# EAGLE design amplifier_v0001 (EAGLE 6.4)
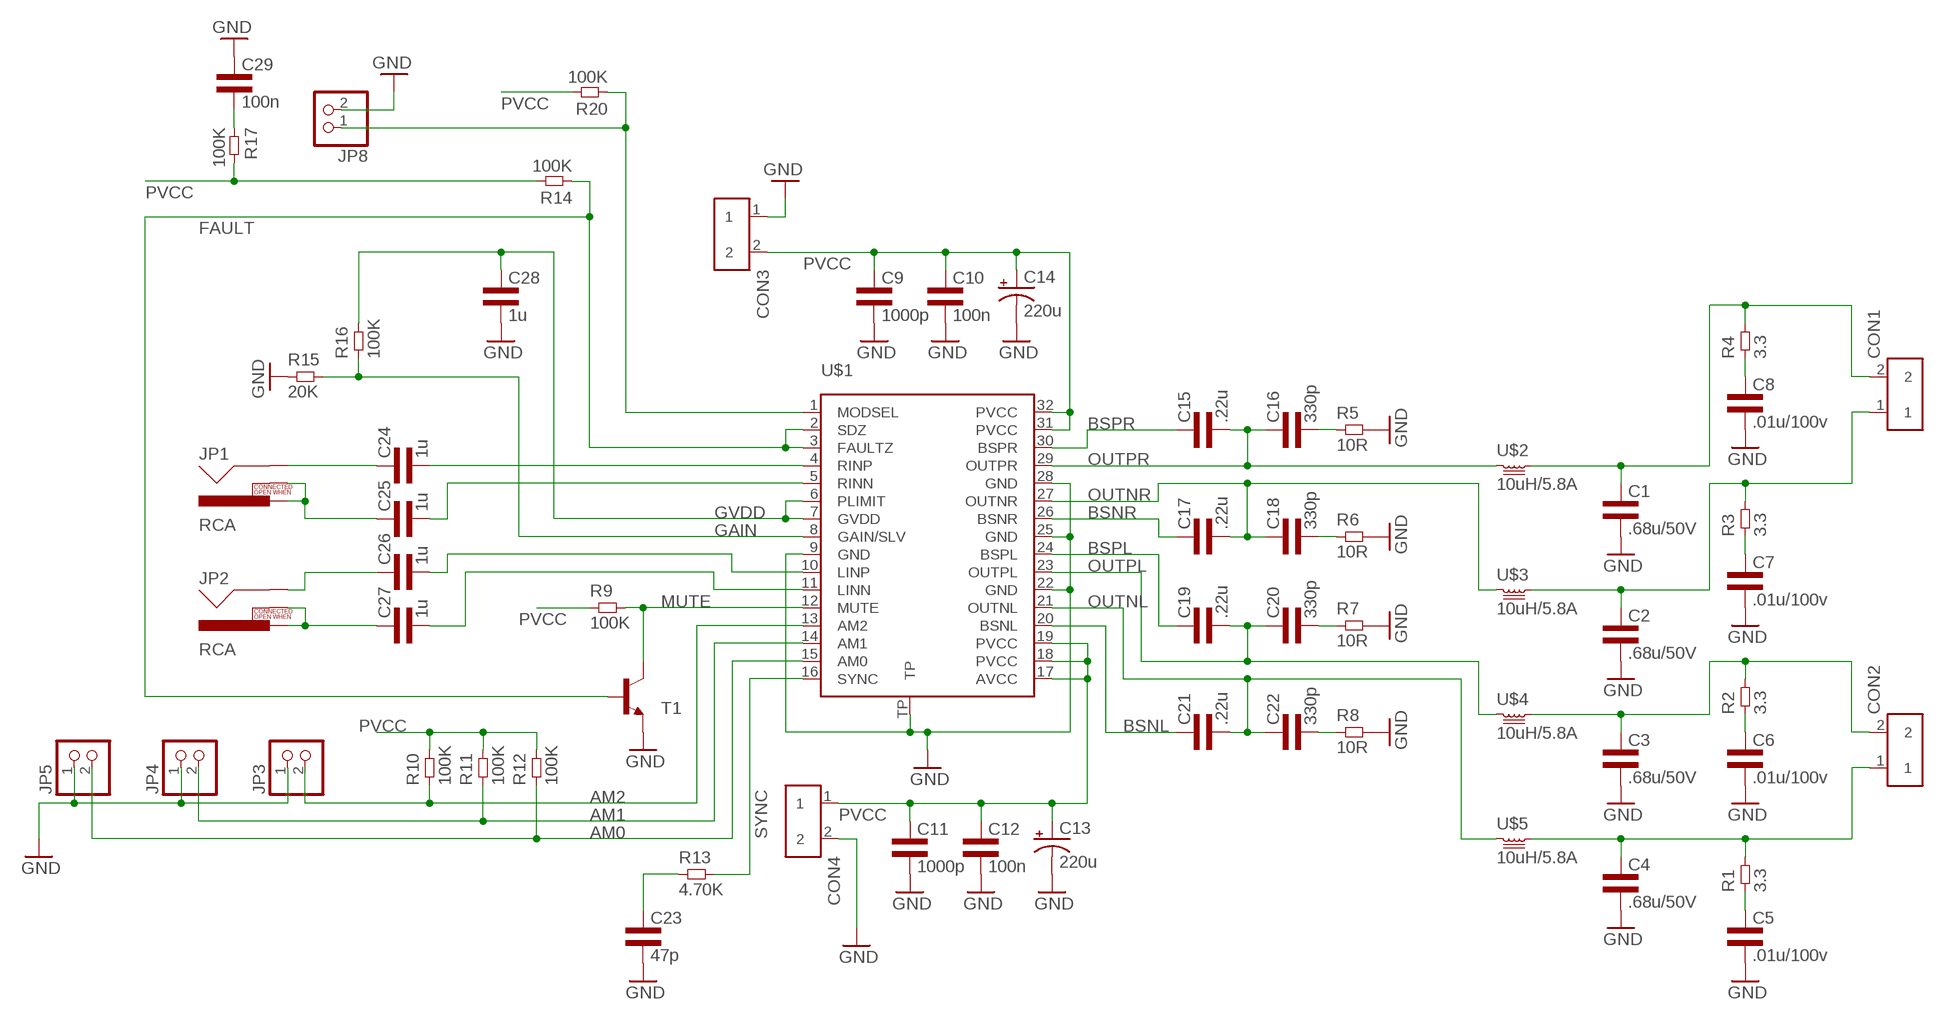
[diagram p0: schematic, sheet 1]

## Parts
C1  .68u/50V  CAP1206L3  [1206L3]
C2  .68u/50V  CAP1206L3  [1206L3]
C3  .68u/50V  CAP1206L3  [1206L3]
C4  .68u/50V  CAP1206L3  [1206L3]
C5  .01u/100v  CAP0805L3  [0805L3]
C6  .01u/100v  CAP0805L3  [0805L3]
C7  .01u/100v  CAP0805L3  [0805L3]
C8  .01u/100v  CAP0805L3  [0805L3]
C9  1000p  CAP0603L3  [0603L3]
C10  100n  CAP0603L3  [0603L3]
C11  1000p  CAP0603L3  [0603L3]
C12  100n  CAP0603L3  [0603L3]
C13  220u  CPOL-USE3.5-8  [E3,5-8]
C14  220u  CPOL-USE3.5-8  [E3,5-8]
C15  .22u  CAP0603L3  [0603L3]
C16  330p  CAP0603L3  [0603L3]
C17  .22u  CAP0603L3  [0603L3]
C18  330p  CAP0603L3  [0603L3]
C19  .22u  CAP0603L3  [0603L3]
C20  330p  CAP0603L3  [0603L3]
C21  .22u  CAP0603L3  [0603L3]
C22  330p  CAP0603L3  [0603L3]
C23  47p  CAP0603L3  [0603L3]
C24  1u  CAP0603L3  [0603L3]
C25  1u  CAP0603L3  [0603L3]
C26  1u  CAP0603L3  [0603L3]
C27  1u  CAP0603L3  [0603L3]
C28  1u  CAP0603L3  [0603L3]
C29  100n  CAP0603L3  [0603L3]
CON1  TERM_BLOCK_2  [TERM_BLOCK_2]
CON2  TERM_BLOCK_2  [TERM_BLOCK_2]
CON3  TERM_BLOCK_2  [TERM_BLOCK_2]
CON4  TERM_BLOCK_2  [TERM_BLOCK_2]
JP1  RCA  [RCA]
JP2  RCA  [RCA]
JP3  PINHD-1X2  [1X02]
JP4  PINHD-1X2  [1X02]
JP5  PINHD-1X2  [1X02]
JP8  PINHD-1X2  [1X02]
R1  3.3  RES0603L3  [0603L3]
R2  3.3  RES0603L3  [0603L3]
R3  3.3  RES0603L3  [0603L3]
R4  3.3  RES0603L3  [0603L3]
R5  10R  RES0805L3  [0805L3]
R6  10R  RES0805L3  [0805L3]
R7  10R  RES0805L3  [0805L3]
R8  10R  RES0805L3  [0805L3]
R9  100K  RES0603L3  [0603L3]
R10  100K  RES0603L3  [0603L3]
R11  100K  RES0603L3  [0603L3]
R12  100K  RES0603L3  [0603L3]
R13  4.70K  RES0603L3  [0603L3]
R14  100K  RES0603L3  [0603L3]
R15  20K  RES0603L3  [0603L3]
R16  100K  RES0603L3  [0603L3]
R17  100K  RES0603L3  [0603L3]
R20  100K  RES0603L3  [0603L3]
T1  TRANSISTOR_MMBT2222ALT1-NPN-SOT23-BEC  [TRANSISTOR_SOT23-BEC]
U$1  TPA3116  [R-PDSO-32]
U$2  10uH/5.8A  INDUCTORDR127  [DR127]
U$3  10uH/5.8A  INDUCTORDR127  [DR127]
U$4  10uH/5.8A  INDUCTORDR127  [DR127]
U$5  10uH/5.8A  INDUCTORDR127  [DR127]

## Nets
AM0: JP5.2 R12.P$1 U$1.15(AM0)
AM1: JP4.2 R11.P$1 U$1.14(AM1)
AM2: JP3.2 R10.P$1 U$1.13(AM2)
BSNL: C21.P$1 U$1.20(BSNL)
BSNR: C17.P$1 U$1.26(BSNR)
BSPL: C19.P$1 U$1.24(BSPL)
BSPR: C15.P$1 U$1.30(BSPR)
FAULT: R14.P$1 T1.B U$1.2(SDZ) U$1.3(FAULTZ)
GAIN: R15.P$2 R16.P$1 U$1.8(GAIN/SLV)
GND: C1.2 C2.2 C3.2 C4.2 C5.2 C6.2 C7.2 C8.2 C9.P$2 C10.P$2 C11.P$2 C12.P$2 C13.- C14.- C23.P$2 C28.P$2 C29.P$1 CON3.1 CON4.2 JP3.1 JP4.1 JP5.1 JP8.2 R5.2 R6.2 R7.2 R8.2 R15.P$1 T1.E U$1.9(GND) U$1.22(GND) U$1.25(GND) U$1.28(GND) U$1.TP
GVDD: C28.P$1 R16.P$2 U$1.6(PLIMIT) U$1.7(GVDD)
LEFT+: C3.1 CON2.2 R2.P$2 U$4.2
LEFT-: C4.1 CON2.1 R1.P$2 U$5.2
MUTE: R9.P$2 T1.C U$1.12(MUTE)
N$1: C27.P$2 U$1.11(LINN)
N$2: C26.P$2 U$1.10(LINP)
N$3: C24.P$2 U$1.4(RINP)
N$4: JP8.1 R20.P$1 U$1.1(MODSEL)
N$5: C16.P$2 R5.1
N$6: C25.P$2 U$1.5(RINN)
N$7: C29.P$2 R17.P$1
N$8: C18.P$2 R6.1
N$9: C5.1 R1.P$1
N$10: C6.1 R2.P$1
N$11: C7.1 R3.P$1
N$12: C8.1 R4.P$1
N$14: C20.P$2 R7.1
N$17: C24.P$1 JP1.SHELL
N$18: C25.P$1 JP1.PIN JP1.SWITCH
N$19: C22.P$2 R8.1
N$20: C23.P$1 R13.P$1
N$23: C27.P$1 JP2.PIN JP2.SWITCH
N$24: C26.P$1 JP2.SHELL
OUTNL: C21.P$2 C22.P$1 U$1.21(OUTNL) U$5.1
OUTNR: C17.P$2 C18.P$1 U$1.27(OUTNR) U$3.1
OUTPL: C19.P$2 C20.P$1 U$1.23(OUTPL) U$4.1
OUTPR: C15.P$2 C16.P$1 U$1.29(OUTPR) U$2.1
PVCC: C9.P$1 C10.P$1 C11.P$1 C12.P$1 C13.+ C14.+ CON3.2 CON4.1 R9.P$1 R10.P$2 R11.P$2 R12.P$2 R14.P$2 R17.P$2 R20.P$2 U$1.17(AVCC) U$1.18(PVCC) U$1.19(PVCC) U$1.31(PVCC) U$1.32(PVCC)
RIGHT+: C1.1 CON1.2 R4.P$2 U$2.2
RIGHT-: C2.1 CON1.1 R3.P$2 U$3.2
SYNC: R13.P$2 U$1.16(SYNC)

## Library data of the parts
C1-C12 C15-C29 = common:CAP
C13 C14 = rcl:CPOL-US: POLARIZED CAPACITOR, American symbol
CON1-CON4 = common:TERM_BLOCK_2
JP1 JP2 = SparkFun-Connectors:RCA
JP3-JP5 JP8 = pinhead:PINHD-1X2: PIN HEADER
R1-R17 R20 = common:RES
T1 = logic:TRANSISTOR_*-NPN-: NPN Transistror BF959 corrected 2008.03.06
U$1 = common:TPA3116: TPA3116D2 15-W, 30-W, 50-W Filter-Free Class-D Stereo Amplifier Family With AM Avoidance
U$2-U$5 = common:INDUCTOR

## Board
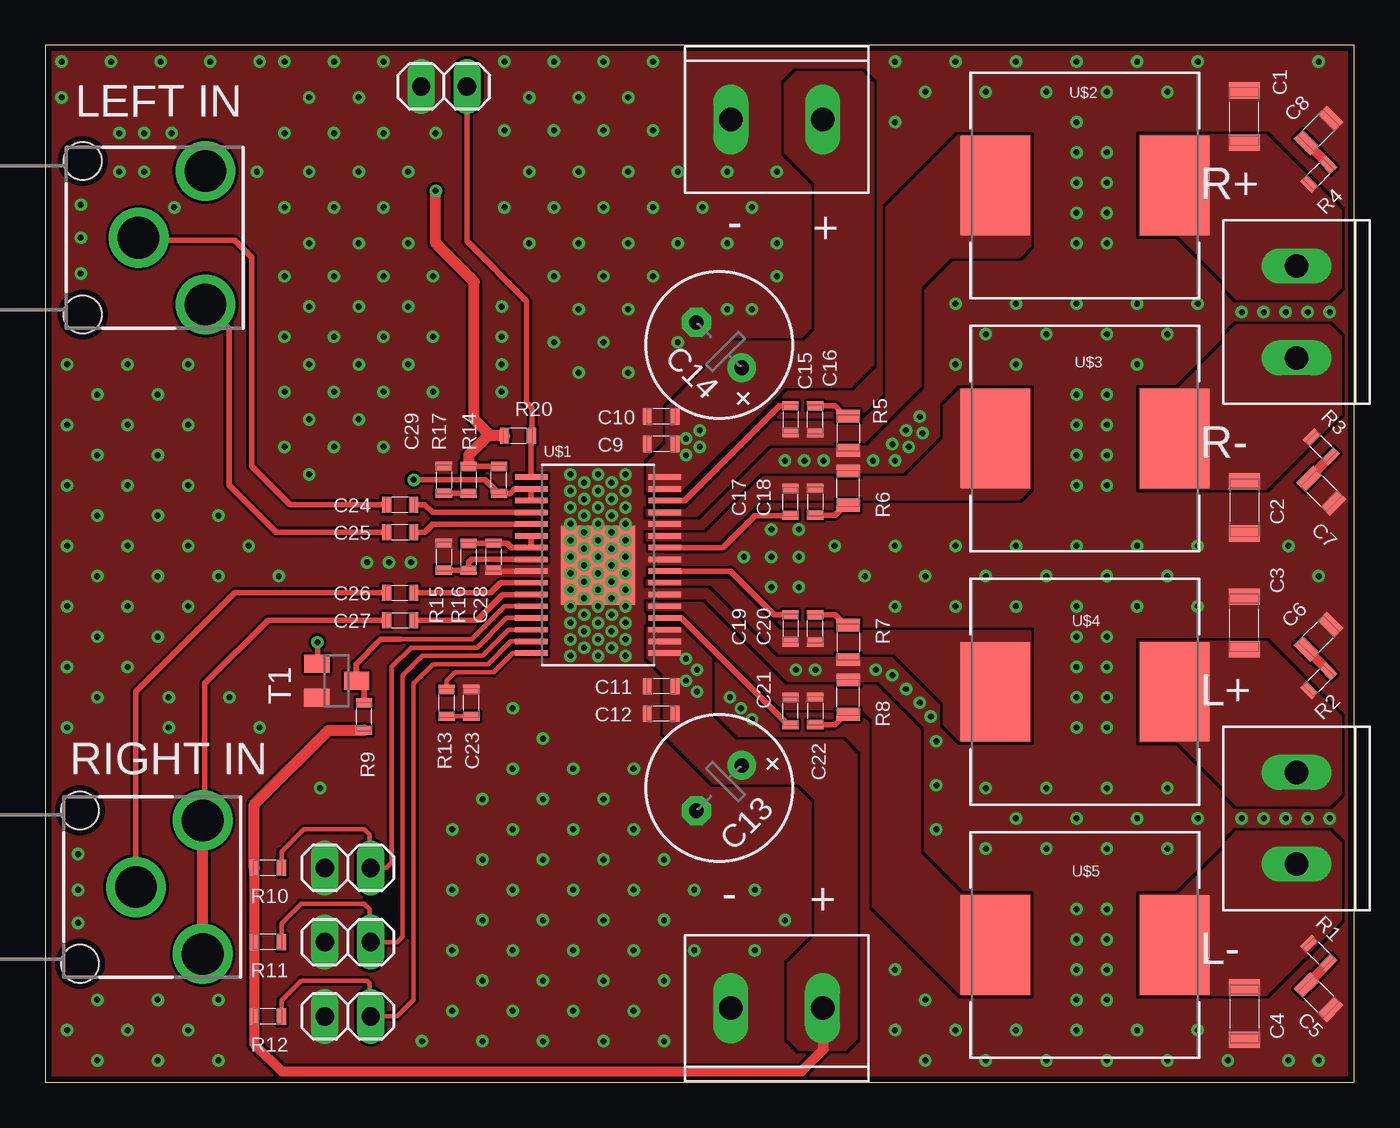
[diagram p1: board, top side]
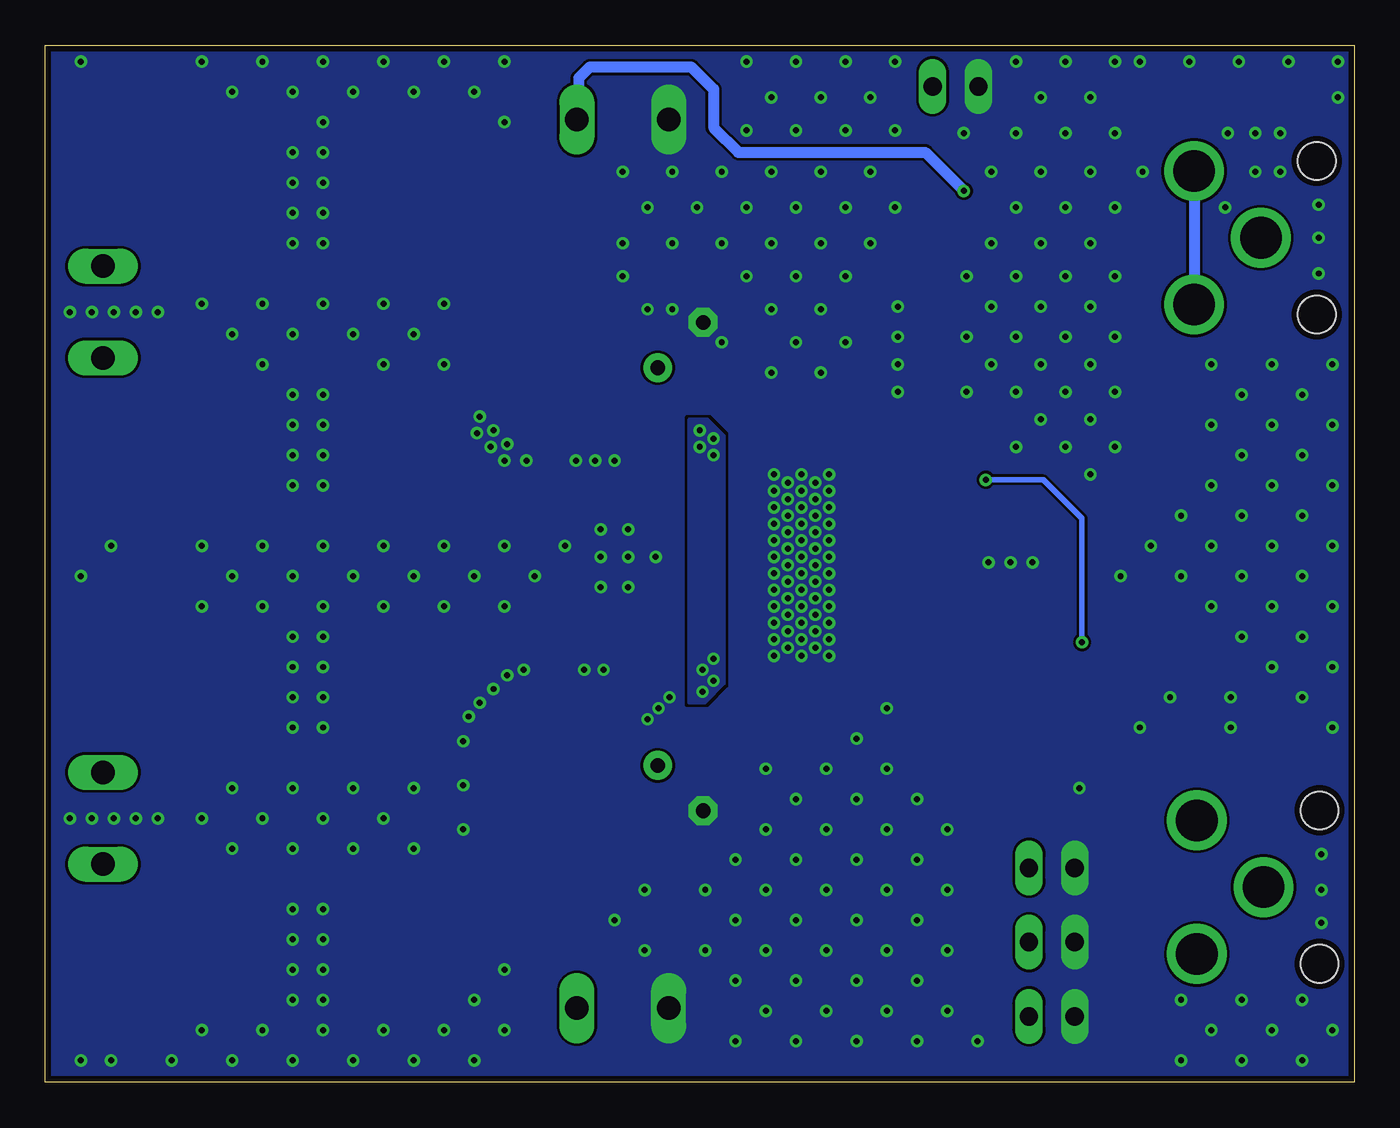
[diagram p2: board, bottom side, seen from below]

Size 72.54 x 57.45 mm. Coordinates in mm from the lower left corner, seen from the top.
Outline: 72.54,0 72.54,57.46 0,57.46 0,0 72.54,0
Copper layers (1*16): Top 0.035mm / dielectric 1.5mm / Bottom 0.035mm
Design rules "default *": minimum track width 6mil, minimum drill 13mil, track to track 6mil, track to pad 6mil, pad to pad 6mil, via to via 6mil, smd to smd 6mil, copper to edge 13mil, drill to drill 6mil, minimum pad ring 7mil, minimum via ring 7mil, stop-mask expansion 4mil, vias tented up to drill 16mil, thermal gap 10mil

### Footprints (pad centres in the part's own frame; a part is rotated, then mirrored left to right if it is on the bottom)
1206L3 = smd 0.9 x 1.7: 1 -1.45,0; 2 1.45,0
0805L3 = smd 0.7 x 1.3: 1 -0.95,0; 2 0.95,0
0603L3 = smd 0.5 x 0.9: P$1 -0.75,0; P$2 0.75,0
E3,5-8 = drill 0.813 pad 1.6: + -1.778,0 | drill 0.813 pad 1.6 octagon: - 1.778,0
TERM_BLOCK_2 = drill 1.3 long: 1 -2.54,0; 2 2.54,0
RCA = drill 2.3: PIN 3.7,3.7; SHELL 0,0; SWITCH 3.7,-3.7 | hole 2.1: -3.1,4.25; -3.1,-4.25
1X02 = drill 1.016 long: 1 -1.27,0; 2 1.27,0
TRANSISTOR_SOT23-BEC = smd 1 x 1.4: B -0.95,-1.1; C 0,1.1; E 0.95,-1.1
R-PDSO-32 = smd 0.3 x 1.8: 1 -4.875,-3.7; 2 -4.225,-3.7; 3 -3.575,-3.7; 4 -2.925,-3.7; 5 -2.275,-3.7; 6 -1.625,-3.7; 7 -0.975,-3.7; 8 -0.325,-3.7; 9 0.325,-3.7; 10 0.975,-3.7; 11 1.625,-3.7; 12 2.275,-3.7; 13 2.925,-3.7; 14 3.575,-3.7; 15 4.225,-3.7; 16 4.875,-3.7; 17 4.875,3.7; 18 4.225,3.7; 19 3.575,3.7; 20 2.925,3.7; 21 2.275,3.7; 22 1.625,3.7; 23 0.975,3.7; 24 0.325,3.7; 25 -0.325,3.7; 26 -0.975,3.7; 27 -1.625,3.7; 28 -2.275,3.7; 29 -2.925,3.7; 30 -3.575,3.7; 31 -4.225,3.7; 32 -4.875,3.7 | smd 4.36 x 4.11: TP 0,0
DR127 = smd 3.85 x 5.5: 1 -4.975,0; 2 4.975,0

### Placement (x,y rotation side)
C1  66.45,53.49 90 top
C2  66.45,31.85 270 top
C3  66.45,25.45 90 top
C4  66.45,3.81 270 top
C5  70.56,4.72 315 top
C6  70.56,24.69 45 top
C7  70.71,32.77 315 top
C8  70.56,52.73 45 top
C9  34.14,35.36 180 top
C10  34.14,36.88 180 top
C11  34.14,21.95 180 top
C12  34.14,20.42 180 top
C13  37.34,16.31 225 top
C14  37.34,40.84 135 top
C15  41.3,36.73 270 top
C16  42.67,36.73 90 top
C17  41.3,32.16 90 top
C18  42.67,32.16 270 top
C19  41.3,25.15 270 top
C20  42.67,25.15 90 top
C21  41.3,20.57 90 top
C22  42.67,20.57 270 top
C23  23.62,21.03 90 top
C24  19.66,32 0 top
C25  19.66,30.48 0 top
C26  19.66,27.13 0 top
C27  19.66,25.6 0 top
C28  24.84,29.11 270 top
C29  22.1,33.38 270 top
CON1  69.34,42.67 90 top
CON2  69.34,14.63 90 top
CON3  40.54,4.11 0 top
CON4  40.54,53.34 180 top
JP1  5.18,46.79 0 top
JP2  5.03,10.82 0 top
JP3  16.76,11.89 0 top
JP4  16.76,7.77 0 top
JP5  16.76,3.66 0 top
JP8  22.1,55.17 180 top
R1  70.56,7.16 135 top
R2  70.56,22.25 225 top
R3  70.71,35.2 135 top
R4  70.56,50.29 225 top
R5  44.5,35.97 270 top
R6  44.5,32.92 90 top
R7  44.5,24.38 270 top
R8  44.5,21.34 90 top
R9  17.68,20.27 90 top
R10  12.34,11.89 180 top
R11  12.34,7.77 180 top
R12  12.34,3.66 180 top
R13  22.25,21.03 90 top
R14  25.15,33.38 90 top
R15  22.1,29.11 270 top
R16  23.47,29.11 90 top
R17  23.47,33.38 90 top
R20  26.21,35.81 180 top
T1  16.15,22.25 270 top
U$1  30.63,28.65 270 top
U$2  57.61,49.68 0 top
U$3  57.61,35.66 0 top
U$4  57.61,21.64 0 top
U$5  57.61,7.62 0 top

### Tracks (layer width: path | path; a pad name or v marks a point on that pad's centre or on a via)
AM0
  Top 0.254: U$1.15 25.8,24.43 24.54,23.17 21.49,23.17 20.42,22.1 20.42,4.57 19.51,3.66 JP5.2 17.98,3.71 17.98,5.49 17.83,5.64 14.17,5.64 13.09,4.56 R12.P$1
AM1
  Top 0.254: U$1.14 25.69,25.08 24.23,23.62 20.88,23.62 19.81,22.56 19.81,8.08 19.51,7.77 JP4.2 17.98,7.82 17.98,9.6 17.68,9.91 14.17,9.91 13.09,8.83 R11.P$1
AM2
  Top 0.254: U$1.13 25.57,25.73 23.93,24.08 20.27,24.08 19.2,23.01 19.2,12.19 18.9,11.89 JP3.2 17.98,11.94 17.98,13.72 17.68,14.02 14.33,14.02 13.09,12.79 R10.P$1
BSNL
  Top 0.305: U$1.20 35.23,25.73 41.15,19.81 41.29,19.81 C21.P$1
BSNR
  Top 0.305: U$1.26 37.55,29.63 39.32,31.39 41.29,31.39 C17.P$1
BSPL
  Top 0.305: U$1.24 37.97,28.33 40.39,25.91 41.29,25.91 C19.P$1
BSPR
  Top 0.305: U$1.30 35.43,32.23 40.69,37.49 41.29,37.49 C15.P$1
FAULT  (via drill 0.33)
  Top 0.305: U$1.3 U$1.2 26.02,32.88 25.76,32.61 25.16,32.61 R14.P$1 24.38,33.38 v20.42,33.38 | v15.09,24.38 15.09,23.23 T1.B
  Bottom 0.305: v15.09,24.38 15.09,31.24 17.22,33.38 v20.42,33.38
GAIN
  Top 0.305: R15.P$2 23.32,28.36 | 23.32,28.36 R16.P$1 | U$1.8 23.64,28.98 23.47,28.8 23.47,28.51 23.32,28.36
GND  (via drill 0.33)
  Top 0.305: U$1.9 24.87,28.33 C28.P$2
  other vias: 42.06,34.44 43.13,34.44 29.11,30.02 29.11,29.11 29.11,28.19 29.11,27.28 29.87,29.57 29.87,28.65 29.87,27.74 29.87,26.82 29.87,30.48 30.63,30.02 30.63,29.11 30.63,28.19 30.63,27.28 31.39,30.48 31.39,29.57 31.39,28.65 31.39,27.74 31.39,26.82 32.16,27.28 32.16,28.19 32.16,29.11 32.16,30.02 29.11,30.94 29.11,31.85 29.11,32.77 29.11,33.68 29.87,31.39 29.87,32.31 29.87,33.22 30.63,33.68 30.63,32.77 30.63,31.85 30.63,30.94 31.39,33.22 31.39,32.31 31.39,31.39 32.16,33.68 32.16,32.77 32.16,31.85 32.16,30.94 29.11,26.37 29.11,25.45 29.11,24.54 29.11,23.62 29.87,25.91 29.87,24.99 29.87,24.08 30.63,26.37 30.63,25.45 30.63,24.54 30.63,23.62 31.39,25.91 31.39,24.99 31.39,24.08 32.16,26.37 32.16,25.45 32.16,24.54 32.16,23.62 41,34.44 38.71,29.11 40.23,29.11 40.23,30.63 40.23,27.43 41.76,29.11 41.76,30.63 41.76,27.43 37.95,21.34 39.17,20.12 38.56,20.73 41.61,22.86 42.67,22.86 46.02,22.86 46.94,22.56 47.7,21.79 48.46,21.03 49.07,20.27 49.38,18.9 49.38,16.46 49.38,14.02 66.29,14.63 67.51,14.63 68.73,14.63 69.95,14.63 71.17,14.63 71.17,42.67 69.95,42.67 68.73,42.67 67.51,42.67 66.29,42.67 45.87,34.44 47.09,34.44 47.85,35.2 47.85,35.2 48.62,35.97 46.94,35.36 47.7,36.12 48.46,36.88 0.91,56.54 3.66,56.54 6.4,56.54 9.14,56.54 11.89,56.54 13.26,56.54 16,56.54 25.45,56.54 28.19,56.54 30.94,56.54 33.68,56.54 0.91,54.56 14.63,54.56 17.37,54.56 13.26,52.58 16,52.58 26.82,54.56 29.57,54.56 32.31,54.56 28.19,52.73 30.94,52.73 33.68,52.73 29.57,50.44 32.31,50.44 14.63,50.44 17.37,50.44 33.68,48.46 30.94,48.46 28.19,48.46 25.45,52.73 26.82,50.44 25.45,48.46 26.82,46.48 29.57,46.48 32.31,46.48 33.68,44.65 30.94,44.65 28.19,44.65 32.31,42.82 29.57,42.82 28.19,41 30.94,41 29.57,39.32 32.31,39.32 13.26,48.46 16,48.46 17.37,46.48 14.63,46.48 16,44.65 13.26,44.65 14.63,42.98 17.37,42.98 13.26,41.3 16,41.3 17.37,39.78 14.63,39.78 35.05,50.44 37.8,50.44 40.54,50.44 36.42,48.46 39.17,48.46 35.05,46.48 37.8,46.48 40.54,46.48 40.54,44.65 37.8,42.82 39.17,42.82 35.05,41 13.26,38.25 16,38.25 14.63,36.73 17.37,36.73 13.26,35.2 16,35.2 18.75,56.54 18.75,52.58 18.75,48.46 18.75,44.65 18.75,41.3 18.75,38.25 18.75,35.2 21.64,52.58 20.12,50.44 14.63,33.68 21.49,38.25 20.12,39.78 21.49,41.3 20.12,42.98 21.49,44.65 20.12,46.48 11.73,50.44 25.3,41.3 25.3,39.78 25.3,38.25 25.3,42.98 7.01,52.58 5.49,52.58 4.11,52.58 5.49,50.44 4.11,50.44 1.98,48.62 7.16,48.46 25.91,20.73 27.58,19.05 25.91,17.37 29.26,17.37 30.94,15.7 32.61,17.37 27.58,15.7 29.26,14.02 30.94,12.34 32.61,10.67 34.29,8.99 32.61,14.02 34.29,12.34 35.97,10.67 24.23,15.7 25.91,14.02 27.58,12.34 29.26,10.67 30.94,8.99 32.61,7.32 34.29,5.64 22.56,14.02 24.23,12.34 25.91,10.67 27.58,8.99 29.26,7.32 30.94,5.64 32.61,3.96 34.29,2.29 30.94,2.29 27.58,2.29 24.23,2.29 20.88,2.29 29.26,3.96 25.91,3.96 22.56,3.96 24.23,5.64 27.58,5.64 25.91,7.32 24.23,8.99 22.56,10.67 22.56,7.32 1.22,39.78 4.57,39.78 2.9,38.1 7.92,39.78 6.25,38.1 1.22,36.42 4.57,36.42 7.92,36.42 2.9,34.75 6.25,34.75 1.22,33.07 4.57,33.07 7.92,33.07 2.9,31.39 6.25,31.39 7.92,29.72 4.57,29.72 1.22,29.72 11.28,29.72 2.9,28.04 6.25,28.04 9.6,28.04 1.22,26.37 4.57,26.37 7.92,26.37 2.9,24.69 6.25,24.69 1.22,23.01 4.57,23.01 2.9,21.34 1.22,19.66 9.6,31.39 12.95,28.04 1.22,2.9 2.9,4.57 4.57,2.9 6.25,4.57 7.92,2.9 9.6,4.57 6.25,1.22 2.9,1.22 9.6,1.22 35.97,7.32 39.32,7.32 41,8.99 39.32,10.67 47.09,56.54 48.77,54.86 50.44,56.54 52.12,54.86 53.8,56.54 55.47,54.86 57.15,56.54 58.83,54.86 60.5,56.54 62.18,54.86 63.86,56.54 57.15,53.19 58.83,51.51 58.83,48.16 57.15,46.48 53.8,43.13 50.44,43.13 52.12,41.45 50.44,39.78 53.8,39.78 55.47,41.45 57.15,43.13 60.5,43.13 63.86,43.13 58.83,41.45 62.18,41.45 60.5,39.78 57.15,38.1 57.15,36.42 57.15,34.75 57.15,33.07 58.83,38.1 58.83,36.42 58.83,34.75 58.83,33.07 43.74,29.72 47.09,29.72 50.44,29.72 53.8,29.72 57.15,29.72 60.5,29.72 63.86,29.72 45.42,28.04 48.77,28.04 52.12,28.04 55.47,28.04 58.83,28.04 62.18,28.04 47.09,26.37 50.44,26.37 53.8,26.37 57.15,26.37 60.5,26.37 63.86,26.37 57.15,24.69 57.15,23.01 57.15,21.34 57.15,19.66 58.83,24.69 58.83,23.01 58.83,21.34 58.83,19.66 52.12,16.31 55.47,16.31 58.83,16.31 62.18,16.31 53.8,14.63 57.15,14.63 60.5,14.63 63.86,14.63 52.12,12.95 55.47,12.95 58.83,12.95 62.18,12.95 57.15,9.6 58.83,9.6 58.83,7.92 58.83,6.25 57.15,6.25 57.15,7.92 57.15,4.57 58.83,4.57 47.09,6.25 47.09,2.9 48.77,4.57 48.77,1.22 50.44,2.9 53.8,2.9 57.15,2.9 60.5,2.9 63.86,2.9 52.12,1.22 55.47,1.22 58.83,1.22 62.18,1.22 65.53,1.22 70.56,1.22 68.88,1.22 70.56,28.04 68.88,29.72 57.15,51.51 57.15,49.83 57.15,48.16 58.83,49.83 58.83,46.48 6.86,21.34 6.86,19.66 10.21,21.34 11.89,19.66 47.09,53.19 70.56,56.54 15.24,16.31 20.27,28.8 19.05,28.8 17.83,28.8 1.83,12.65 1.83,10.67 1.83,8.84 1.98,46.79 1.98,44.81
  pour Top (rank 6, no thermals): 0.3,0.3 0.3,57.15 72.24,57.15 72.24,0.3
  pour Bottom (rank 6, no thermals): 0.3,0.3 0.3,57.15 72.24,57.15 72.24,0.3
GVDD
  Top 0.305: U$1.6 U$1.7 25.85,29.63 25.6,29.87 24.85,29.87 C28.P$1 R16.P$2
LEFT+
  pour Top (no thermals): 60.66,18.9 62.79,18.9 65.38,16.31 65.38,16 65.99,15.39 71.17,15.39 71.78,16 71.78,20.27 67.67,24.38 60.66,24.38
LEFT-
  pour Top (no thermals): 60.66,4.88 67.67,4.88 71.78,8.99 71.78,13.26 71.17,13.87 65.99,13.87 65.38,13.26 65.38,12.95 62.79,10.36 60.66,10.36
MUTE
  Top 0.254: U$1.12 25.46,26.38 23.62,24.54 19.66,24.54
  Top 0.305: 19.66,24.54 18.59,24.54 17.22,23.17 17.22,22.28 T1.C 17.68,21.83 R9.P$2
N$1
  Top 0.305: U$1.11 25.35,27.03 23.93,25.6 C27.P$2
N$2
  Top 0.305: U$1.10 25.24,27.68 24.69,27.13 C26.P$2
N$3
  Top 0.305: U$1.4 21.46,31.58 21.03,32 C24.P$2
N$4
  Top 0.305: U$1.1 26.93,35.78 R20.P$1 26.98,35.83 26.98,37.34 26.67,37.64 26.67,43.28 23.37,46.58 JP8.1
N$5
  Top 0.305: C16.P$2 43.75,37.48 44.35,36.88 44.47,36.88 R5.1
N$6
  Top 0.305: U$1.5 21.48,30.93 21.03,30.48 C25.P$2
N$7
  Top 0.305: R17.P$1 C29.P$2
N$8
  Top 0.305: C18.P$2 43.75,31.41 44.35,32 44.47,32 R6.1
N$9
  Top 0.559: R1.P$1 71.09,6.6 C5.1
N$10
  Top 0.559: R2.P$1 71.09,22.82 C6.1
N$11
  Top 0.559: C7.1 70.04,33.47 R3.P$1
N$12
  Top 0.559: R4.P$1 71.09,50.86 C8.1
N$14
  Top 0.305: C20.P$2 43.75,25.9 44.2,25.45 44.38,25.45 R7.1
N$17
  Top 0.305: C24.P$1 13.56,32 11.43,34.14 11.43,45.72 10.52,46.63 5.18,46.63 JP1.SHELL
N$18
  Top 0.305: C25.P$1 12.8,30.48 10.21,33.07 10.21,41.76 JP1.SWITCH
  Bottom 0.61: JP1.PIN JP1.SWITCH
N$19
  Top 0.305: C22.P$2 43.75,19.82 44.35,20.42 44.47,20.42 R8.1
N$20
  Top 0.254: R13.P$1 C23.P$1
N$23
  Top 0.305: C27.P$1 12.34,25.6 8.84,22.1 8.84,14.63 JP2.PIN
  Top 0.61: JP2.SWITCH JP2.PIN
N$24
  Top 0.305: C26.P$1 10.52,27.13 5.03,21.64 JP2.SHELL
OUTNL
  pour Top (no thermals): 33.38,26.21 35.36,26.21 40.84,20.73 45.26,20.73 45.87,20.12 45.87,9.75 50.75,4.88 54.56,4.88 54.56,10.36 50.75,10.36 48.46,12.65 48.46,19.51 46.02,21.95 41,21.95 36.42,26.52 33.38,26.52
OUTNR
  pour Top (no thermals): 33.38,30.4 36.65,30.4 39.78,33.53 47.7,33.53 49.83,35.66 49.83,37.49 50.75,38.4 54.56,38.4 54.56,32.92 53.95,32.31 39.62,32.31 37.34,30.02 33.38,30.02
OUTPL
  pour Top (no thermals): 33.38,27.81 37.87,27.81 40.69,24.99 54.56,24.99 54.56,18.9 50.75,18.9 49.83,19.81 49.83,21.03 47.09,23.77 40.69,23.77 36.88,27.58 33.38,27.58
OUTPR
  pour Top (no thermals): 33.38,31.7 35.51,31.7 40.39,36.58 45.26,36.58 46.63,37.95 46.63,48.46 50.6,52.43 54.56,52.43 54.56,46.33 53.95,45.72 50.14,45.72 48.46,44.04 48.46,38.56 45.26,35.36 40.08,35.36 36.12,31.39 33.38,31.39
PVCC  (via drill 0.33)
  Top 0.305: R14.P$2 R17.P$2 23.47,34.29
  Top 0.559: R10.P$2 R11.P$2 R12.P$2 11.59,2.12 13.11,0.61 41.91,0.61 43.13,1.83 43.13,4.06 CON3.2
  Top 0.61: 24.69,35.81 24.54,35.81 23.47,34.75 23.47,34.29 | R20.P$2 24.69,35.81 | 24.69,35.81 23.77,36.73 23.77,44.35 21.64,46.48 v21.64,49.38 | R10.P$2 11.59,15.4 15.7,19.51 R9.P$1
  Bottom 0.61: CON4.1 42.98,53.44 42.98,55.63 42.37,56.24 36.73,56.24 35.51,55.02 35.51,52.88 34.14,51.51 23.77,51.51 v21.64,49.38
  other vias: 35.51,34.75 36.27,35.2 35.51,23.47 36.12,22.86 36.27,36.12 35.51,35.66 35.51,22.25 36.12,21.64
  pour Top (no thermals): 33.38,25.15 33.38,23.55 34.29,22.63 34.29,19.35 37.03,16.61 41.76,16.61 42.67,15.7 42.67,8.08 41.15,6.55 41.15,2.44 41.76,1.83 44.35,1.83 44.96,2.44 44.96,18.14 44.2,18.9 38.25,18.9 36.88,20.27 36.88,23.47 35.2,25.15 35.2,25.07 35.13,25.15
  pour Top (no thermals): 33.38,32.77 35.2,32.77 40.54,38.1 41,38.56 44.65,38.56 45.87,39.78 45.87,55.32 45.26,55.93 41.61,55.93 41,55.32 41,51.51 42.67,49.83 42.67,41.61 42.06,41 38.1,41 34.44,37.34 34.44,35.36 33.38,34.29
  pour Bottom (no thermals): 36.88,36.73 36.88,21.03 35.97,21.03 34.9,22.1 34.9,35.81 35.81,36.73
RIGHT+
  pour Top (no thermals): 60.66,46.94 62.79,46.94 65.38,44.35 65.38,44.04 65.99,43.43 71.17,43.43 71.78,44.04 71.78,48.31 67.67,52.43 60.66,52.43
RIGHT-
  pour Top (no thermals): 60.66,32.92 67.67,32.92 71.78,37.03 71.78,41.3 71.17,41.91 65.99,41.91 65.38,41.3 65.38,41 62.79,38.4 60.66,38.4
SYNC
  Top 0.254: U$1.16 25.91,23.78 24.84,22.71 22.71,22.71 22.25,22.25 R13.P$2

### Text on the board
tPlace: LEFT IN | R+ | - | - | + | R- | L+ | RIGHT IN | - | + | L-